# Altium schematic sheet circuitProtection.SchDoc
size A4; SheetNumber: 2; SheetTotal: 4
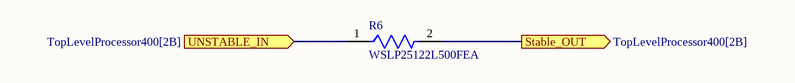
[diagram p0: circuitProtection.SchDoc]

## Parts
R6  WSLP25122L500FEA  [FP-WSLP2512-0R001-0R0049-MFG]

## Ports
Stable_OUT (out, see TopLevelProcessor400[2B]), UNSTABLE_IN (in, see TopLevelProcessor400[2B])

## Nets
Stable_OUT: R6.2 ; port Stable_OUT
UNSTABLE_IN: R6.1 ; port UNSTABLE_IN

## Library data of the parts
R6 = CMP-00030-58203087-1: WSLP25122L500FEA SMD Chip Resistor, 2.5 MOhm, ± 1%, 3 W, 2512 [6332 Metric], Metal Strip, Power; NexarPartId: 58203087; RoHS: Non-Compliant